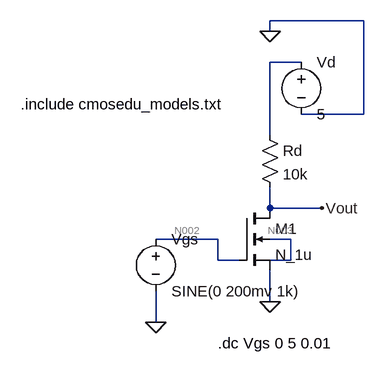
[diagram p0: schematic Trabalho2.asc]
Trabalho2.asc, the LTspice schematic file:
Version 4
SHEET 1 880 680
WIRE 288 -160 144 -160
WIRE 144 -144 144 -160
WIRE 192 -96 144 -96
WIRE 288 -16 288 -160
WIRE 288 -16 192 -16
WIRE 144 16 144 -96
WIRE 144 128 144 96
WIRE 224 128 144 128
WIRE 64 176 -32 176
WIRE 176 176 144 176
WIRE 64 208 64 176
WIRE 96 208 64 208
WIRE 176 208 176 176
WIRE 176 208 144 208
WIRE 144 272 144 224
WIRE -32 304 -32 256
FLAG -32 304 0
FLAG 144 272 0
FLAG 144 -144 0
FLAG 224 128 Vout
SYMBOL nmos4 96 128 R0
SYMATTR InstName M1
SYMATTR Value N_1u
SYMATTR Value2 l=1.5u w=3u
SYMBOL voltage -32 160 R0
WINDOW 123 0 0 Left 2
WINDOW 39 0 0 Left 2
SYMATTR InstName Vgs
SYMATTR Value SINE(0 200mv 1k)
SYMBOL res 128 0 R0
SYMATTR InstName Rd
SYMATTR Value 10k
SYMBOL voltage 192 -112 R0
SYMATTR InstName Vd
SYMATTR Value 5
TEXT 64 336 Left 2 !.dc Vgs 0 5 0.01
TEXT -240 -32 Left 2 !.include cmosedu_models.txt

The netlist it stands for:
* Trabalho2.asc
M1 Vout N002 0 N003 N_1u l=1.5u w=3u
Vgs N002 0 SINE(0 200mv 1k)
Rd N001 Vout 10k
Vd N001 0 5
.model NMOS NMOS
.model PMOS PMOS
.lib standard.mos
.dc Vgs 0 5 0.01
.include cmosedu_models.txt
.backanno
.end

* Results of the author's LTspice run, read from the files saved beside the schematic
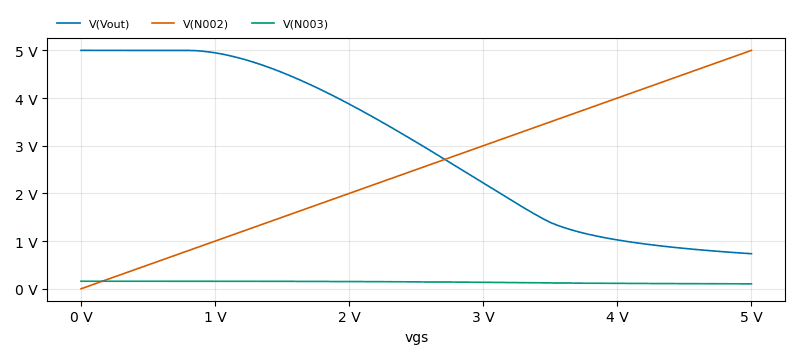
[diagram p1: DC transfer characteristic of Trabalho2.asc, plotted from the saved traces]
* DC transfer characteristic, 1 run:
*   V(Vout): 5 V at vgs=0 V, 735.2 mV at vgs=5 V, min 735.2 mV, max 5 V
*   V(N002): 0 V at vgs=0 V, 5 V at vgs=5 V, min 0 V, max 5 V
*   V(N003): 159.1 mV at vgs=0 V, 103.6 mV at vgs=5 V, min 103.6 mV, max 159.1 mV